# Altium schematic sheet BrushlessMotorAndEncoder.SchDoc
size A
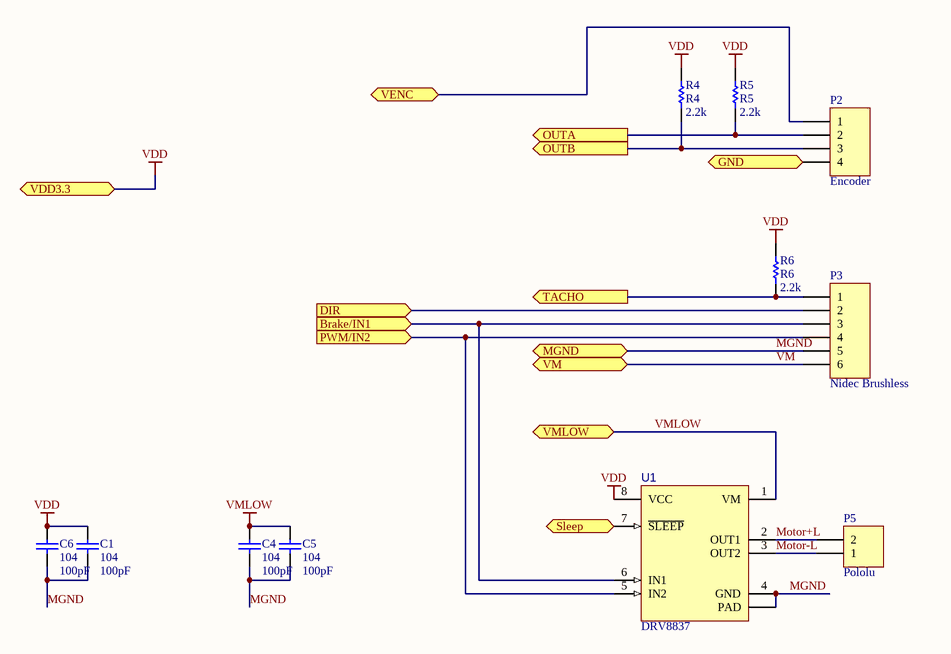
[diagram p0: BrushlessMotorAndEncoder.SchDoc]

## Parts
C1  104  value 100pF  [CAP_0805]
C4  104  value 100pF  [CAP_0805]
C5  104  value 100pF  [CAP_0805]
C6  104  value 100pF  [CAP_0805]
P2  Encoder  [PH_4_PTH]
P3  Nidec Brushless  [PH_6_PTH]
P5  Pololu  [PH_2_PTH]
R4  R4  value 2.2k  [RES_0805]
R5  R5  value 2.2k  [RES_0805]
R6  R6  value 2.2k  [RES_0805]
U1  DRV8837  [DSG0008A]

## Ports
Brake/IN1 (in), DIR (in), GND, MGND, OUTA (out), OUTB (out), PWM/IN2 (in), Sleep (in), TACHO (out), VDD3.3, VENC, VM, VMLOW

## Nets
VDD: C1.2 C6.2 R4.2 R5.2 R6.2 U1.8(VCC) ; port VDD3.3
VMLOW: C4.2 C5.2 U1.1(VM) ; port VMLOW
Brake/IN1: P3.3 U1.6(IN1) ; port Brake/IN1
DIR: P3.2 ; port DIR
GND: P2.4 ; port GND
MGND: C1.1 C4.1 C5.1 C6.1 P3.5 U1.4(GND) U1.9(PAD) ; port MGND
Motor+L: P5.2 U1.2(OUT1)
Motor-L: P5.1 U1.3(OUT2)
OUTA: P2.2 R5.1 ; port OUTA
OUTB: P2.3 R4.1 ; port OUTB
PWM/IN2: P3.4 U1.5(IN2) ; port PWM/IN2
Sleep: U1.7(~{SLEEP}) ; port Sleep
TACHO: P3.1 R6.1 ; port TACHO
VENC: P2.1 ; port VENC
VM: P3.6 ; port VM

## Library data of the parts
C1 C4-C6 = Cap: Capacitor; Published: 8-Jun-2000; LatestRevisionDate: 17-Jul-2002; LatestRevisionNote: Re-released for DXP Platform.; PackageReference: RAD-0.3; Publisher: Altium Limited; PackageDescription: Radial Cap, Thru-Hole; 2 Leads; 0.3 in Pin Spacing
P2 = Header 4: Header, 4-Pin; LatestRevisionDate: 17-Jul-2002; LatestRevisionNote: Re-released for DXP Platform.; Publisher: Altium Limited
P3 = Header 6: Header, 6-Pin; LatestRevisionDate: 17-Jul-2002; LatestRevisionNote: Re-released for DXP Platform.; Publisher: Altium Limited
P5 = Header 2: Header, 2-Pin; LatestRevisionDate: 17-Jul-2002; LatestRevisionNote: Re-released for DXP Platform.; Publisher: Altium Limited
R4-R6 = Res1: Resistor; Published: 8-Jun-2000; LatestRevisionDate: 17-Jul-2002; LatestRevisionNote: Re-released for DXP Platform.; PackageReference: AXIAL-0.3; Publisher: Altium Limited; PackageDescription: Axial Device, Thru-Hole; 2 Leads; 0.3 in Pin Spacing
U1 = DRV8837DSG: LOW-VOLTAGE H-BRIDGE IC, DSG0008A; Alternate Manufacturer: None; Manufacturer: Texas Instruments; SymbolCreator: a0411947; U/M: EA; SymbolVersion: 2013-08-22; PartNumber: DRV8837DSG; PackageReference: DSG0008A; MountType: SMT; ComponentLink1Description: Datasheet Link; ComponentLink1URL: http://www.ti.com/lit/ds/symlink/drv8837.pdf; CompType: IC; RoHS: Y; Publisher: Texas Instruments; LatestRevisionDate: 2013-09-10; LatestRevisionNote: Added Parts